# Altium schematic sheet Connector.SchDoc: Connectors
size B; Date: 01/03/2026; Author: John Ulm; Organization: ORGANIZATION; Address1: ADDRESS 1; Address2: ADDRESS 2; Address3: ADDRESS 3; Address4: ADDRESS 4; Revision: -; SheetNumber: 1; SheetTotal: 6; ENG_APP_DATE: --/--/--; DSN_APP_DATE: --/--/--; CHK_APP_DATE: --/--/--
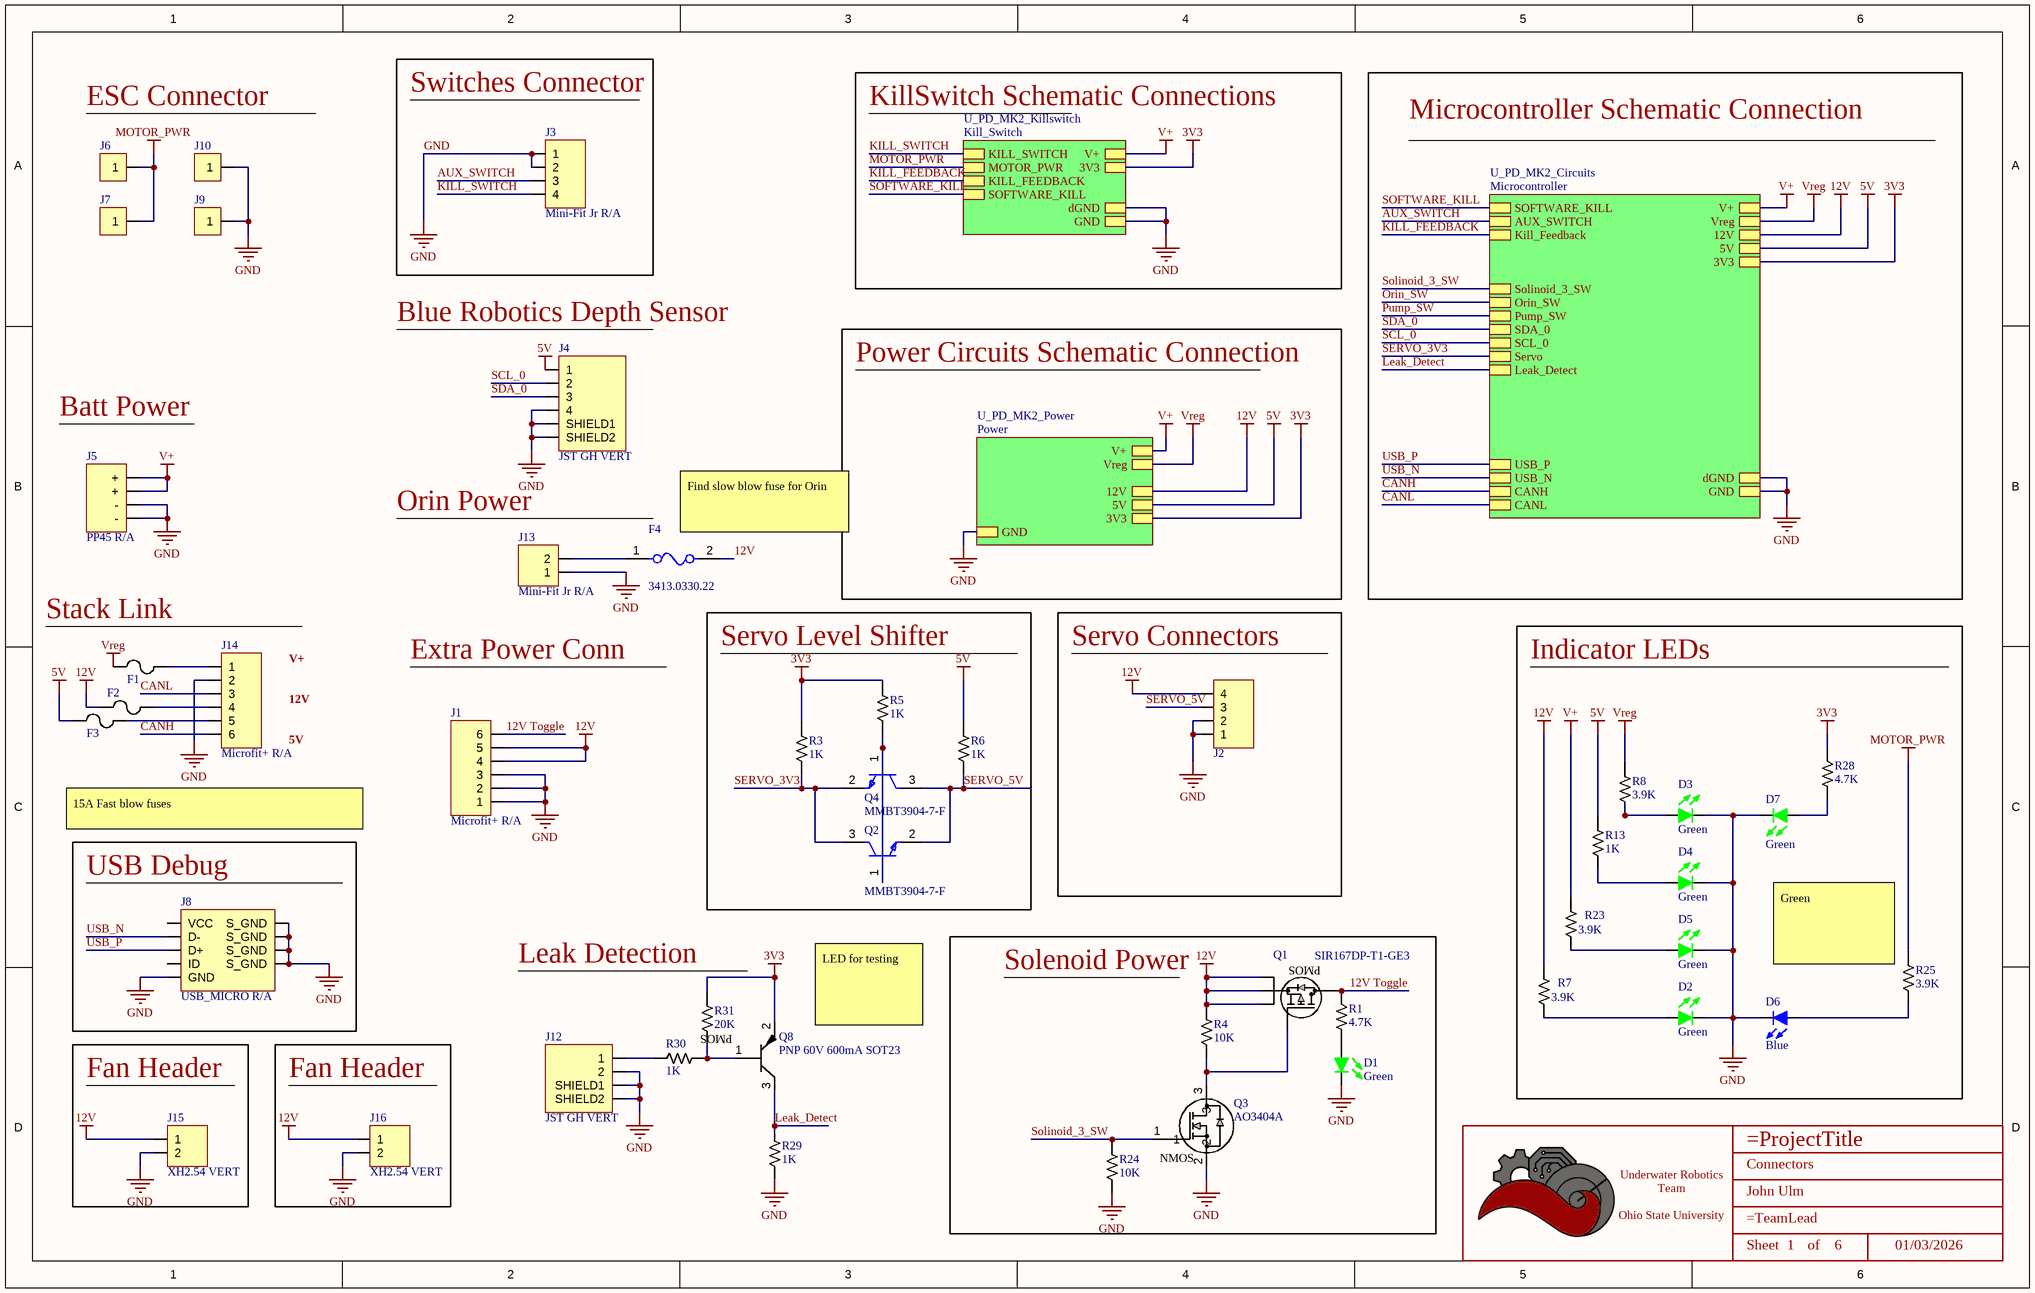
[diagram p0: Connector.SchDoc]

## Parts
*  Title_Block  [LOGO]  (value not drawn)  (graphical)
D1  Color: Green  [LED_0603]  (hidden comment: IN-S63AT5G)
D2  Color: Green  [LED_0603]  (hidden comment: IN-S63AT5G)
D3  Color: Green  [LED_0603]  (hidden comment: IN-S63AT5G)
D4  Color: Green  [LED_0603]  (hidden comment: IN-S63AT5G)
D5  Color: Green  [LED_0603]  (hidden comment: IN-S63AT5G)
D6  Color: Blue  [LED_0603]  (hidden comment: 150060BS75000)
D7  Color: Green  [LED_0603]  (hidden comment: IN-S63AT5G)
F1  0685H9150-01  [0501Series_LTF]  (value not drawn)
F2  0685H9150-01  [0501Series_LTF]  (value not drawn)
F3  0685H9150-01  [0501Series_LTF]  (value not drawn)
F4  3413.0330.22  [FP-3413_0330_22-MFG]
J1  Microfit+ R/A  [CONN_MOLEX_MICROFIT_6_POS_R/A]
J2  Microfit+ R/A  [CONN_MOLEX_MICROFIT_4_POS_R/A]  (value not drawn)
J3  Mini-Fit Jr R/A  [CONN_MOLEX_MINIFIT JR_4 POS_R/A]
J4  JST GH VERT  [CONN_JST_BM04B-GHS-TBT(LF)(SN)(N)]
J5  PP45 R/A  [CONN_ANDERSON_PP45_4 POS_R/A]
J6  Redcube M4 Term 85A  [Redcube M4 Term 85A]  (value not drawn)
J7  Redcube M4 Term 85A  [Redcube M4 Term 85A]  (value not drawn)
J8  USB_MICRO R/A  [CONN_MINIUSB]
J9  Redcube M4 Term 85A  [Redcube M4 Term 85A]  (value not drawn)
J10  Redcube M4 Term 85A  [Redcube M4 Term 85A]  (value not drawn)
J12  JST GH VERT  [CONN_JST_SM02B-GHS-TB(LF)(SN)]
J13  Mini-Fit Jr R/A  [CONN_MOLEX_MINIFIT JR_2 POS_R/A]
J14  Microfit+ R/A  [CONN_MOLEX_MICROFIT_6_POS_R/A]
J15  XH2.54 VERT  [CONN_JST_XH254_2POS_VERT]
J16  XH2.54 VERT  [CONN_JST_XH254_2POS_VERT]
Q1  SIR167DP-T1-GE3  [MOSFET_7DP-T1-GE3_VIS]
Q2  MMBT3904-7-F  [FP-SOT23-IPC_A]
Q3  AO3404A  [SOT-23-3]
Q4  MMBT3904-7-F  [FP-SOT23-IPC_A]
Q8  PNP 60V 600mA SOT23  [SOT-23-3]
R1  Value  (Ohms): 4.7K  [RESISTOR_0603]  (hidden comment: 4.7k Ohm 5% 1/10W)
R3  Value  (Ohms): 1K  [RESISTOR_0603]  (hidden comment: 1k Ohm 5% 1/8W)
R4  Value  (Ohms): 10K  [RESISTOR_0603]  (hidden comment: 10k Ohm 5% 1/10W)
R5  Value  (Ohms): 1K  [RESISTOR_0603]  (hidden comment: 1k Ohm 5% 1/8W)
R6  Value  (Ohms): 1K  [RESISTOR_0603]  (hidden comment: 1k Ohm 5% 1/8W)
R7  Value  (Ohms): 3.9K  [RESISTOR_0603]  (hidden comment: 3.9k Ohm 5% 1/10W)
R8  Value  (Ohms): 3.9K  [RESISTOR_0603]  (hidden comment: 3.9k Ohm 5% 1/10W)
R13  Value  (Ohms): 1K  [RESISTOR_0603]  (hidden comment: 1k Ohm 5% 1/8W)
R23  Value  (Ohms): 3.9K  [RESISTOR_0603]  (hidden comment: 3.9k Ohm 5% 1/10W)
R24  Value  (Ohms): 10K  [RESISTOR_0603]  (hidden comment: 10k Ohm 5% 1/10W)
R25  Value  (Ohms): 3.9K  [RESISTOR_0603]  (hidden comment: 3.9k Ohm 5% 1/10W)
R28  Value  (Ohms): 4.7K  [RESISTOR_0603]  (hidden comment: 4.7k Ohm 5% 1/10W)
R29  Value  (Ohms): 1K  [RESISTOR_0603]  (hidden comment: 1k Ohm 5% 1/8W)
R30  Value  (Ohms): 1K  [RESISTOR_0603]  (hidden comment: 1k Ohm 5% 1/8W)
R31  Value  (Ohms): 20K  [RESISTOR_0402]  (hidden comment: 20k Ohm 1% 1/16W)

## Blocks framed on the sheet
Switches Connector: J3
Servo Level Shifter: Q2 Q4 R3 R5 R6
Servo Connectors: J2
Indicator LEDs: D2-D7 R7 R8 R13 R23 R25 R28
USB Debug: J8
Solenoid Power: D1 Q1 Q3 R1 R4 R24
Fan Header: J15
Fan Header: J16

## Sub-sheets
U_PD_MK2_Circuits = Microcontroller: GND, V+, 5V, 3V3, SOFTWARE_KILL, AUX_SWITCH, 12V, dGND, Vreg, USB_P, USB_N, CANH, CANL, Kill_Feedback, Solinoid_3_SW, Orin_SW, SDA_0, SCL_0, Pump_SW, Servo, Leak_Detect
U_PD_MK2_Killswitch = Kill_Switch: KILL_SWITCH, MOTOR_PWR, V+, 3V3, dGND, GND, KILL_FEEDBACK, SOFTWARE_KILL
U_PD_MK2_Power = Power: GND, V+, 5V, 3V3, Vreg, 12V

## Nets
3V3: Q8.2 R3.1 R5.1 R28.2 R31.1 ; sheet U_PD_MK2_Power/3V3, sheet U_PD_MK2_Circuits/3V3, sheet U_PD_MK2_Killswitch/3V3
5V: F3.1 J4.1 R6.1 R13.1 ; sheet U_PD_MK2_Power/5V, sheet U_PD_MK2_Circuits/5V
12V: F2.1 F4.2 J1.4 J1.5 J2.4 J15.1 J16.1 Q1.1(S) Q1.2(S) Q1.3(S) R4.1 R7.1 ; sheet U_PD_MK2_Power/12V, sheet U_PD_MK2_Circuits/12V
GND: D1.2 D2.2 D3.2 D4.2 D5.2 D6.2 D7.2 J1.1 J1.2 J1.3 J2.1 J2.2 J3.1 J3.2 J4.4 J4.S1(SHIELD1) J4.S2(SHIELD2) J5.3(-) J5.4(-) J8.5(GND) J8.6(S_GND) J8.7(S_GND) J8.8(S_GND) J8.9(S_GND) J9.1 J10.1 J12.2 J12.S1(SHIELD1) J12.S2(SHIELD2) J13.1 J14.2 J15.2 J16.2 Q3.2 R24.2 R29.2 ; sheet U_PD_MK2_Power/GND, sheet U_PD_MK2_Circuits/GND, sheet U_PD_MK2_Circuits/dGND, sheet U_PD_MK2_Killswitch/dGND, sheet U_PD_MK2_Killswitch/GND
MOTOR_PWR: J6.1 J7.1 R25.1 ; sheet U_PD_MK2_Killswitch/MOTOR_PWR
V+: J5.1(+) J5.2(+) R23.1 ; sheet U_PD_MK2_Power/V+, sheet U_PD_MK2_Circuits/V+, sheet U_PD_MK2_Killswitch/V+
Vreg: F1.1 R8.1 ; sheet U_PD_MK2_Power/Vreg, sheet U_PD_MK2_Circuits/Vreg
12V Toggle: J1.6 Q1.D R1.2
AUX_SWITCH: J3.3 ; sheet U_PD_MK2_Circuits/AUX_SWITCH
CANH: J14.6 ; sheet U_PD_MK2_Circuits/CANH
CANL: J14.3 ; sheet U_PD_MK2_Circuits/CANL
KILL_FEEDBACK: sheet U_PD_MK2_Circuits/Kill_Feedback, sheet U_PD_MK2_Killswitch/KILL_FEEDBACK
KILL_SWITCH: J3.4 ; sheet U_PD_MK2_Killswitch/KILL_SWITCH
Leak_Detect: Q8.3 R29.1 ; sheet U_PD_MK2_Circuits/Leak_Detect
Orin_SW: sheet U_PD_MK2_Circuits/Orin_SW
Pump_SW: sheet U_PD_MK2_Circuits/Pump_SW
SCL_0: J4.2 ; sheet U_PD_MK2_Circuits/SCL_0
SDA_0: J4.3 ; sheet U_PD_MK2_Circuits/SDA_0
SERVO_3V3: Q2.3(C) Q4.2(E) R3.2 ; sheet U_PD_MK2_Circuits/Servo
SERVO_5V: J2.3 Q2.2(E) Q4.3(C) R6.2
SOFTWARE_KILL: sheet U_PD_MK2_Circuits/SOFTWARE_KILL, sheet U_PD_MK2_Killswitch/SOFTWARE_KILL
Solinoid_3_SW: Q3.1 R24.1 ; sheet U_PD_MK2_Circuits/Solinoid_3_SW
USB_N: J8.2(D-) ; sheet U_PD_MK2_Circuits/USB_N
USB_P: J8.3(D+) ; sheet U_PD_MK2_Circuits/USB_P
NetD1_1: D1.1 R1.1
NetD2_1: D2.1 R7.2
NetD3_1: D3.1 R8.2
NetD4_1: D4.1 R13.2
NetD5_1: D5.1 R23.2
NetD6_1: D6.1 R25.2
NetD7_1: D7.1 R28.1
NetF1_2: F1.2 J14.1
NetF2_2: F2.2 J14.4
NetF3_2: F3.2 J14.5
NetF4_1: F4.1 J13.2
NetJ12_1: J12.1 R30.2
NetQ1_4: Q1.4(G) Q3.3 R4.2
NetQ2_1: Q2.1(B) Q4.1(B) R5.2
NetQ8_1: Q8.1 R30.1 R31.2

Not connected (* = marked no-connect by the designer): J8 1(VCC) 4(ID)

## Notes on the sheet
- ESC Connector
- KillSwitch Schematic Connections
- Microcontroller Schematic Connection
- (near J4) Blue Robotics Depth Sensor
- Power Circuits Schematic Connection
- Batt Power
- Orin Power
- (near F4) Find slow blow fuse for Orin
- Stack Link
- V+
- 12V
- Extra Power Conn
- 5V
- 15A Fast blow fuses
- (near R31) Leak Detection
- (near R25) Green
- (near Q8) LED for testing
- DWG. NO.
- REV.
- SHT.
- THIS DOCUMENT AND THE DATA DISCLOSED HEREIN OR HEREWITH IS THE PROPERTY OF ALTIUM LIMITED AND MAY BE FREELY DISTRIBUTED IN WHOLE. NO RIGHTS ARE RESERVED OR EXPRESS OR IMPLIED WARANTEE GIVEN.
- REVISION
- DESCRIPTION
- DATE
- APPROVED
- ENG:
- APPROVALS
- PROJECT
- DSN:
- CHK:
- REFERENCE DOCUMENTS
- PROJECT REVISION:
- TITLE
- DOCUMENT REVISION:
- DESIGN ITEM:
- BOM:
- FAB DWG:
- PCB DWG:
- ASSY DWG:
- SCALE:
- SIZE
- B
- CAGE CODE
- FILE NAME
- DWG NO.
- SHEET
- OF
- REV
- (in symbol AO3404A) NMOS
- (in symbol MMBT2907A-7-F) PMOS
- (in symbol SIR167DP-T1-GE3) PMOS
- (in symbol Title_Block) Underwater Robotics Team / Ohio State University; Sheet; of

## Library data of the parts
* = Title_Block: UWRT Schematic Title Block Template / Created June 2021, Dylan Trainor
D1-D5 D7 = LED_Green_0603_3V: LED Green Vf= 3V If = 0.005A / IN-S63AT5G; Made By: Robert Pafford; Forward Current: 5mA; ComponentLink1Description: Datasheet; ComponentLink1URL: https://www.we-online.de/katalog/datasheet/150060GS75000.pdf; Forward Voltage: 3V; Package: 0603; Supplier 1: Digi-Key; Supplier Part Number 1: 1830-1062-1-ND
D6 = LED_Blue_0603: LED Blue Vf= 3.2V If = 0.020A / 150060BS75000; Made By: Robert Pafford; Forward Current: 20mA; Forward Voltage: 3.2V; Package: 0603; Supplier 1: Digi-Key; Supplier Part Number 1: 732-4966-1-ND
F1-F3 = Bel Fuse 15A: Bel Fuse  | 15A | 32V DC | SMD | Fast Blow | 1206; Current Rating: 15; Breaking Capacity: 150A; Mfr_Name: Bel Fuse; Manufacturer_Part_Number: 0685H9150-01; Voltage Rating: 32V; Response Time: Fast Blow; Package: 1206; Created By: Nathan Ayer
F4 = CMP-26293-000001-1: FUSE BOARD MNT 15A 32VAC 63VDC; Manufacturer: Schurter Inc; Max Fuse Ac Voltage: 32V; Fuse Voltage Drop: 57mV; Value: 3.5mΩ; Voltage Rating: 63V; Fuse Blow Speed: Slow; Fuse Interrupt Dc Current: 100A; Fuse I2T: 65A2Sec; Automotive: No; Ambient Temperature Range High: +90°C; RoHS: TRUE; Digikey Description: FUSE BOARD MNT 15A 32VAC 63VDC; Height: 0.6mm; Manufacturer Part Number: 3413.0330.22; Mouser Description: Surface Mount Fuses UST 1206 FUSE 15A F; Device Class L1: Circuit Protection; Ipc Land Pattern Name: CAPC320160X60; ComponentLink2URL: https://us.schurter.com/en/datasheet/typ_UST_1206.pdf; Resistance: 3.5mΩ; ComponentLink2Description: Datasheet; Octopart: https://octopart.com/3413.0330.22-schurter-8400836; Max Fuse Dc Voltage: 63V; Fuse Current: 15A; Category: Fuse; Device Class L3: unset; Package: 0; Ambient Temperature Range Low: -55°C; Device Class L2: Fuses; Lead Free: Yes
J1 J14 = CONN_MOLEX_MICROFIT+_6POS_R/A: Molex Microfit+ / 212528 6 POS R/A Black; Pitch: 3.0mm; Current Per Pin: 12.5; Supplier 1: Digikey; Supplier Part Number 1: 900-2125280600-ND; Manufacturer: Molex; Configuration: R/A; Color: Black
J2 = CONN_MOLEX_MICROFIT+_4POS_R/A: Molex Microfit+ / 212528 4 POS R/A Black; Pitch: 3.0mm; Current Per Pin: 12.5A; Manufacturer: Molex; Supplier 1: Digikey; Supplier Part Number 1: 900-2125280400-ND; Configuration: R/A; Color: Black
J3 = CONN_MOLEX_MINIFIT JR_4POS_R/A: Molex Minifit Jr. 5569 / 4 Pos R/A Natural; Pitch: 4.2mm; Configuration: Right Angle; Current Per Pin: 13A; Number of Positions: 4; Supplier Part Number 1: WM13112-ND; Supplier 1: Digi-Key; Manufacturer: Molex; Color: Natural; Created By: Flip B; ComponentLink1Description: Datasheet; ComponentLink1URL: https://www.molex.com/pdm_docs/sd/026013115_sd.pdf; Series: Minifit Jr 5569
J4 = CONN_JST_GH_4POS_VERT: JST GH Pitch 4 Pos Vertical; Pitch: 1.25mm; Current Per Pin: 1A; Number of Positions: 4; Manufacturer: JST; Configuration: Vertical; Color: Natural; Created By: Robert P; Series: GH; Supplier 1: Digi-Key; Supplier Part Number 1: 455-1580-1-ND
J5 = CONN_ANDERSON_2x2_R/A: Anderson PP45 / 4 Pos R/A Red/Black; Pitch: 7.9mm; Configuration: Right Angle; Current Per Pin: 45A; Number of Positions: 4; Manufacturer: Anderson; Color: Red/Black; Created By: Flip B; ComponentLink1Description: Datasheet; ComponentLink1URL: https://www.andersonpower.com/content/dam/app/ecommerce/product-pdfs/DS-PP1545.pdf; Series: PowerPole 45; Supplier 1: Digi-Key; Supplier Part Number 1: 2243-1337G1-ND; Supplier 2: Digi-Key; Supplier Part Number 2: 2243-1336G1-ND; Supplier 3: Digi-Key; Supplier Part Number 3: 2243-1327-BK-ND; Supplier 4: Digi-Key; Supplier Part Number 4: A102007-ND
J8 = CONN_MICROUSB: Amphenol Micro USB-B / USB2.0 5 Pin Right Angle SMD; Pitch: 0.65mm; Current Per Pin: 1.8A; Number of Positions: 5; Manufacturer: Amphenol; Configuration: Right Angle; Color: Silver; Created By: Flip B; ComponentLink1Description: Datasheet; ComponentLink1URL: https://cdn.amphenol-icc.com/media/wysiwyg/files/documentation/datasheet/inputoutput/io_usb_micro.pdf?__cf_chl_jschl_tk__=05693735e19256298f6ef6ca2bb2e65c376a4f56-1625503833-0-Abitsb0-ufjOXJYs_S3J3r2iTn-nObalbmXUksF1VvO_h_WEmRdMlUD1I8-hmWSEVWzY1pirKnrPZWfgY3851qyBZe5ZvnNQePLGIzUgdEIQBVUyW36RsbYpDLEWxJ4horD-5gChFgobLYqwmG5aHl0E8lIn_twwPPrOxilK2gP0q9t_CNOs_u5fMqXvXUrlsOv8tIE2NRlu6NVP8qtkL2GjhlkeTUbDMF8WvvpPDTFOgvZ4Y16Ej8F8AhWos88mo5B1HssXozw0XrkJQIqERITUu6rqloz9kf4ZzhBHtDAt-IkiAFY_Ds9SW8FYKKTtINJVpHZQ6Gyu1FFM4Dc9MO0maE8_mmNcwlxqyRoRk_MPWW8VyByXWM5RSp52jteRKw7FeI9WIYvCbPAOy0Eyib-aseIQsnGbglBcUY6_2xp8GYaJM38H3dNvBPsSOfJBPndKedwKHllxjkucXn6xsN0sDXkpGN-cu8_2bDTJ0g-uUucKSCooYX-ApSDNGpkA_p9zv1SOAD8c0zaZVmtiBsN75QpVz2rzq9_BFxOywPvR; Series: 10118192; Supplier 1: Digi-Key; Supplier Part Number 1: 609-4613-1-ND
J12 = CONN_JST_GH_2POS_VERT: JST GH Pitch 2 Pos Vertical; Pitch: 1.25mm; Current Per Pin: 1A; Number of Positions: 4; Manufacturer: JST; Configuration: Vertical; Color: Natural; Created By: Robert P; Series: GH; Supplier 1: Digi-Key; Supplier Part Number 1: 455-1564-1-ND
J13 = CONN_MOLEX_MINIFIT JR_2POS_R/A: Molex Minifit Jr. 5569 / 2 Pos R/A Natural; Pitch: 4.2mm; Configuration: Right Angle; Current Per Pin: 13A; Number of Positions: 2; Manufacturer: Molex; Color: Natural; Created By: Robert P; ComponentLink1Description: Datasheet; ComponentLink1URL: https://www.molex.com/pdm_docs/sd/026013115_sd.pdf; Series: Minifit Jr 5569; Supplier 1: Digi-Key; Supplier Part Number 1: WM1351-ND
J15 J16 = CONN_JST_XH254_2POS_VERT: JST XH 2.54mm Pitch 2 Pos Vertical; Current Per Pin: 4A; Number of Positions: 2; NOTE: Do not use JST 2.5mm parts with this footprint. JST does not make 2.54mm pitch pins, rather only clones make this connector!; Manufacturer: JST; Pitch: 2.54mm; Configuration: Vertical; Color: White; Created By: Robert P; Series: XH 2.54; ComponentLink1Description: Purchase Link; ComponentLink1URL: https://www.amazon.com/460PCS-XH2-54-Connector-Terminal-Connectors/dp/B09DBGVX5C
Q1 = SIR167DP-T1-GE3: P-Channel 30 V 60A (Tc) 65.8W (Tc) Surface Mount PowerPAK® SO-8; Mfr_Name: Vishay; Type: DEV; Copyright: Copyright (C) 2022 Ultra Librarian. All rights reserved.; Manufacturer_Part_Number: SIR167DP-T1-GE3; RefDes: RefDes; Supplier 1: Mouser; Supplier Part Number 1: 78-SIR167DP-T1-GE3
Q2 Q4 = CMP-2000-04931-2: TRANS NPN 40V 0.2A SMD SOT23-3; Frequency: 300MHz; Power Dissipation: 350mW; Element Configuration: Single; Max Power Dissipation: 300mW; Max Collector Current: 200mA; Collector Emitter Saturation Voltage: 300mV; Number of Elements: 1; hFE Min: 100; Collector Base Voltage (VCBO): 60V; Emitter Base Voltage (VEBO): 6V; Contact Plating: Tin; Package Quantity: 3000; Max Frequency: 300MHz; REACH SVHC: No SVHC; Max Operating Temperature: 150°C; Width: 1.4mm; Collector Emitter Voltage (VCEO): 40V; Voltage Rating (DC): 40V; Radiation Hardening: No; Case/Package: SOT-23; Height: 1mm; Collector Emitter Breakdown Voltage: 40V; Length: 3.05mm; Polarity: NPN; Packaging: Tape and Reel; Number of Pins: 3; Min Operating Temperature: -55°C; Gain Bandwidth Product: 300MHz; Mount: Surface Mount; Weight: 0.000282oz; Continuous Collector Current: 200mA; Transition Frequency: 300MHz; Max Breakdown Voltage: 40V; Lead Free: Lead Free
Q3 = AO3404A: N-Channel 30 V 5.8A (Ta) 1.4W (Ta) Surface Mount SOT-23-3; Vendor: Alpha & Omega Semiconductor Inc.; SourceLibrary: ON_Semiconductor_2020-01-13; Vgs (Max): 3V @ 5.8A, 10V; Vgs (th): 3V @ 250µA; Vdss: 30V; Rds (on): 28mOhm @ 5.8A, 10V; Amp Rating: 5.8 A; FET Type: N-Channel; Package: SOT23-3L; Manufacturer _Part_Number: AO3404A; Power Dissipation: 1.4W (Ta); Supplier 1: Digi-Key; Supplier Part Number 1: 785-1004-1-ND; Created By: Dylan T
Q8 = MMBT2907A-7-F: PNP 60 V 600mA Surface Mount SOT-23; Vendor: Digikey; Vgs (Max): ±10V; Vgs (th): 800mV @ 250µA; Vdss: 20 V; Power Dissipation: 1.56W (Tc); Rds (on): 50mOhm @ 3A, 4.5V; Amp Rating: 600mA; BJT Type: PNP; Package: TO-236-3, SC-59, SOT-23-3; Manufacturer_Part_Number: MMBT2907A-7-F; Created By: Robert Pafford; ComponentLink1Description: Datasheet; ComponentLink1URL: https://media.digikey.com/pdf/Data%20Sheets/Diodes%20PDFs/MMBT2907A_Rev2016.pdf; Supplier 1: Digi-Key; Supplier Part Number 1: MMBT2907A-FDICT-ND
R1 R28 = RESISTOR_4.7K_0603: RES 4.7k OHM 5% 1/10W 0603; Tolerance: +/- 5%; Made By: Robert Pafford; Wattage: 1/10W; Supplier: Digikey; Digikey Part Numer: CR0603-JW-104ELFTR-ND; Supplier 1: Digi-Key; Supplier Part Number 1: RMCF0603JT4K70CT-ND
R3 R5 R6 R13 R29 R30 = RESISTOR_1K_0603: RES 1k OHM 5% 1/8W 0603; Tolerance: +/- 5%; Made By: Robert Pafford; ComponentLink1Description: Datasheet; ComponentLink1URL: https://www.bourns.com/docs/product-datasheets/CRxxxxx.pdf; Wattage: 1/8W; Supplier: Digikey; Digikey Part Numer: CR0603-JW-104ELFTR-ND; Supplier 1: Digi-Key; Supplier Part Number 1: 2019-RK73B1JTTD102JCT-ND
R4 R24 = RESISTOR_10K_0603: RES 10k OHM 5% 1/10W 0603; Tolerance: +/- 5%; Wattage: 1/8W; Made By: Robert Pafford; ComponentLink1Description: Datasheet; ComponentLink1URL: https://www.bourns.com/docs/product-datasheets/CRxxxxx.pdf; Supplier: Digikey; Digikey Part Numer: CR0603-JW-104ELFTR-ND; Supplier 1: Digi-Key; Supplier Part Number 1: 2019-RK73B1JTTD103JCT-ND
R7 R8 R23 R25 = RESISTOR_3.9K_0603: RES 3.9k OHM 1% 1/10W 0603; Tolerance: +/- 1%; Made By: Robert Pafford; Wattage: 1/10W; Supplier 1: Digi-Key; Supplier Part Number 1: P3.90KHCT-ND
R31 = RESISTOR_20K_0402: RES 20k OHM 1% 1/16W 0402; Tolerance: +/- 1%; Made By: Robert Pafford; Wattage: 1/16W; Supplier 1: Digikey; Supplier Part Number 1: YAG3454CT-ND
J6 J7 J9 J10 = Redcube M4 Term 85A: Created By: Nahtan Ayer; Current Rating: 85 A; Screw Size: M4